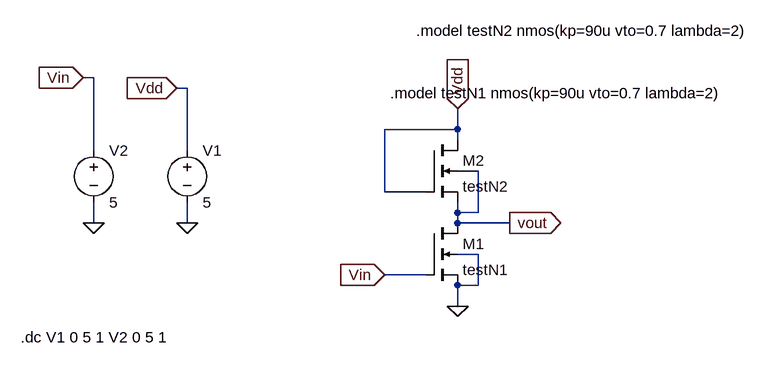
[diagram p0: schematic cs amp nmos diode.asc]
cs amp nmos diode.asc, the LTspice schematic file:
Version 4
SHEET 1 880 680
WIRE -464 0 -480 0
WIRE -320 16 -336 16
WIRE 96 80 96 48
WIRE 96 80 -16 80
WIRE 96 96 96 80
WIRE -464 112 -464 0
WIRE -320 112 -320 16
WIRE 128 144 96 144
WIRE -16 176 -16 80
WIRE 48 176 -16 176
WIRE 96 208 96 192
WIRE 128 208 128 144
WIRE 128 208 96 208
WIRE -464 224 -464 192
WIRE -320 224 -320 192
WIRE 96 224 96 208
WIRE 176 224 96 224
WIRE 128 272 96 272
WIRE 48 304 -16 304
WIRE 128 320 128 272
WIRE 128 320 96 320
WIRE 96 352 96 320
FLAG 96 352 0
FLAG 96 48 Vdd
IOPIN 96 48 In
FLAG -16 304 Vin
IOPIN -16 304 In
FLAG -336 16 Vdd
IOPIN -336 16 In
FLAG -480 0 Vin
IOPIN -480 0 In
FLAG -464 224 0
FLAG -320 224 0
FLAG 176 224 vout
IOPIN 176 224 Out
SYMBOL nmos4 48 224 R0
SYMATTR InstName M1
SYMATTR Value testN1
SYMATTR Value2 l=45u w=18u
SYMBOL nmos4 48 96 R0
SYMATTR InstName M2
SYMATTR Value testN2
SYMATTR Value2 l=45u w=3u
SYMBOL voltage -320 96 R0
WINDOW 123 0 0 Left 0
WINDOW 39 0 0 Left 0
SYMATTR InstName V1
SYMATTR Value 5
SYMBOL voltage -464 96 R0
WINDOW 123 0 0 Left 0
WINDOW 39 0 0 Left 0
SYMATTR InstName V2
SYMATTR Value 5
TEXT -8 24 Left 2 !.model testN1 nmos(kp=90u vto=0.7 lambda=2)
TEXT 32 -72 Left 2 !.model testN2 nmos(kp=90u vto=0.7 lambda=2)
TEXT -576 400 Left 2 !.dc V1 0 5 1 V2 0 5 1

The netlist it stands for:
* cs amp nmos diode.asc
M1 vout Vin 0 0 testN1 l=45u w=18u
M2 Vdd Vdd vout vout testN2 l=45u w=3u
V1 Vdd 0 5
V2 Vin 0 5
.model NMOS NMOS
.model PMOS PMOS
.lib standard.mos
.model testN1 nmos(kp=90u vto=0.7 lambda=2)
.model testN2 nmos(kp=90u vto=0.7 lambda=2)
.dc V1 0 5 1 V2 0 5 1
.backanno
.end